# EAGLE design HB-UNI-SenAct-4-4-RC_V3.0 (EAGLE 9.4.2)
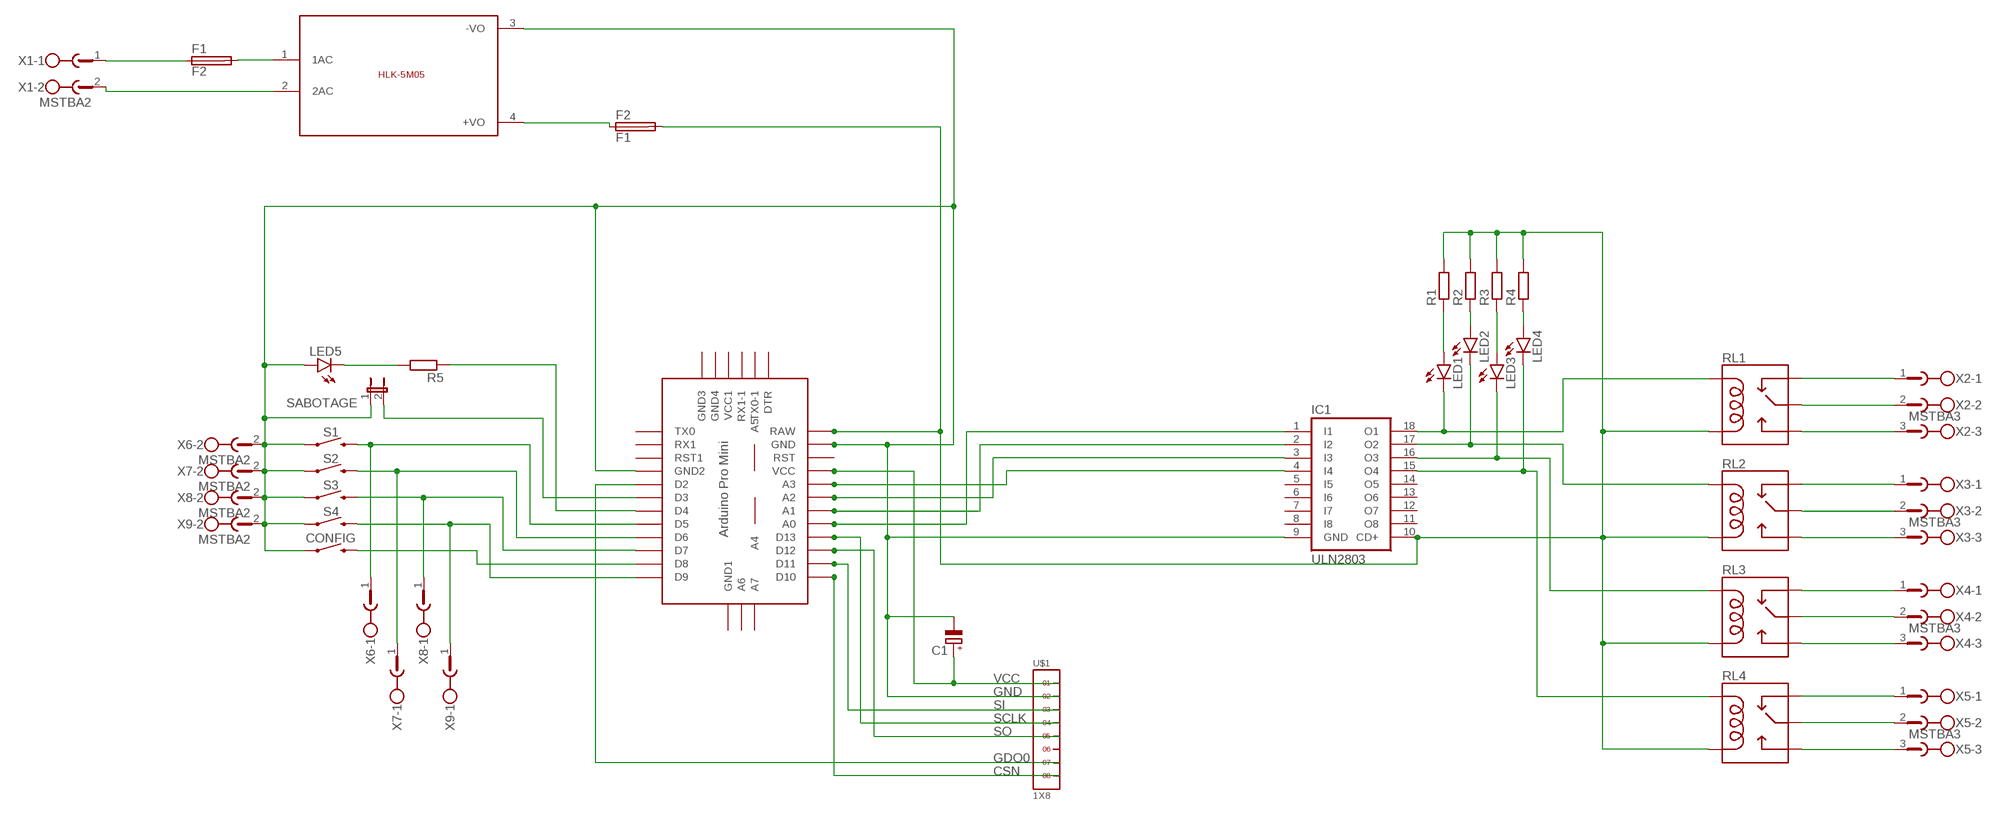
[diagram p0: schematic, sheet 1]

## Parts
C1  CPOL-EUE2.5-5  [E2,5-5]
CONFIG  MOMENTARY-SWITCH-SPST-PTH-6.0MM-KIT  [TACTILE_SWITCH_PTH_6.0MM_KIT]
F1  F2  SH22,5A  [SH22,5A]
F2  F1  SH22,5A  [SH22,5A]
IC1  ULN2803  ULN2803A  [DIL18]
LED1  LED3MM  [LED3MM]
LED2  LED3MM  [LED3MM]
LED3  LED3MM  [LED3MM]
LED4  LED3MM  [LED3MM]
LED5  LED3MM  [LED3MM]
R1  R-EU_0309/10  [0309/10]
R2  R-EU_0309/10  [0309/10]
R3  R-EU_0309/10  [0309/10]
R4  R-EU_0309/10  [0309/10]
R5  R-EU_0309/10  [0309/10]
RL1  RELAYPTH  [SRD-05VDC-SL-C]
RL2  RL2  RELAYPTH  [SRD-05VDC-SL-C]
RL3  RELAYPTH  [SRD-05VDC-SL-C]
RL4  RELAYPTH  [SRD-05VDC-SL-C]
S1  MOMENTARY-SWITCH-SPST-PTH-6.0MM  [TACTILE_SWITCH_PTH_6.0MM]
S2  MOMENTARY-SWITCH-SPST-PTH-6.0MM-KIT  [TACTILE_SWITCH_PTH_6.0MM_KIT]
S3  MOMENTARY-SWITCH-SPST-PTH-6.0MM-KIT  [TACTILE_SWITCH_PTH_6.0MM_KIT]
S4  MOMENTARY-SWITCH-SPST-PTH-6.0MM-KIT  [TACTILE_SWITCH_PTH_6.0MM_KIT]
SABOTAGE  JP1E  [JP1]
U$1  1X8  [1X8]
U$2  ABK-PRO-MINI  [ABK-PRO-MINI]
U$3  5VDC/5W  HLK-5M05  [HLK-5M05]
X1  MSTBA2  [MSTBA2]
X2  MSTBA3  [MSTBA3]
X3  MSTBA3  [MSTBA3]
X4  MSTBA3  [MSTBA3]
X5  MSTBA3  [MSTBA3]
X6  MSTBA2  [MSTBA2]
X7  MSTBA2  [MSTBA2]
X8  MSTBA2  [MSTBA2]
X9  MSTBA2  [MSTBA2]

## Nets
CSN: U$1.8 U$2.D10
GDO0: U$1.7 U$2.D2
GND: C1.- CONFIG.1 IC1.9(GND) LED5.A S1.1 S2.1 S3.1 S4.1 SABOTAGE.1 U$1.2 U$2.GND U$2.GND1(GND2) U$3.3(-VO) X6.2 X7.2 X8.2 X9.2
N$1: IC1.1(I1) U$2.A0
N$2: IC1.2(I2) U$2.A1
N$3: IC1.3(I3) U$2.A2
N$4: IC1.4(I4) U$2.A3
N$5: LED1.A R1.1
N$6: LED2.A R2.1
N$7: LED3.A R3.1
N$8: LED4.A R4.1
N$9: F1.1 X1.1
N$10: F2.1 U$3.4(+VO)
N$11: U$3.2(2AC) X1.2
N$12: S1.3 U$2.D5 X6.1
N$13: S2.3 U$2.D6 X7.1
N$14: S3.3 U$2.D7 X8.1
N$15: S4.3 U$2.D9 X9.1
N$16: CONFIG.3 U$2.D8
N$17: R5.1 U$2.D4
N$18: LED5.K(C) R5.2
N$19: F1.2 U$3.1(1AC)
N$20: SABOTAGE.2 U$2.D3
N$21: RL3.SWCLOSED(SWCLOSE) X4.1
N$22: RL4.SWCOMMON X5.2
N$23: RL3.SWOPEN X4.3
N$24: F2.2 IC1.10(CD+) R1.2 R2.2 R3.2 R4.2 RL1.COIL0 RL2.COIL0 RL3.COIL0 RL4.COIL0 U$2.RAW
N$25: RL4.SWCLOSED(SWCLOSE) X5.1
N$26: RL3.SWCOMMON X4.2
N$27: RL4.SWOPEN X5.3
N$28: RL2.SWOPEN X3.3
N$29: RL2.SWCOMMON X3.2
N$30: RL2.SWCLOSED(SWCLOSE) X3.1
N$31: RL1.SWOPEN X2.3
N$32: RL1.SWCOMMON X2.2
N$33: RL1.SWCLOSED(SWCLOSE) X2.1
N$34: IC1.18(O1) LED1.K(C) RL1.COIL1
N$35: IC1.17(O2) LED2.K(C) RL2.COIL1
N$36: IC1.16(O3) LED3.K(C) RL3.COIL1
N$37: IC1.15(O4) LED4.K(C) RL4.COIL1
SCLK: U$1.4 U$2.D13
SI: U$1.3 U$2.D11
SO: U$1.5 U$2.D12
VCC: C1.+ U$1.1 U$2.VCC
Unconnected: IC1.5(I5) IC1.6(I6) IC1.7(I7) IC1.8(I8) IC1.11(O8) IC1.12(O7) IC1.13(O6) IC1.14(O5) U$1.6 U$2.A4 U$2.A5 U$2.A6 U$2.A7 U$2.DTR U$2.GND2(GND3) U$2.GND3(GND4) U$2.GND4(GND1) U$2.RST U$2.RST1 U$2.RX1 U$2.RX1-1 U$2.TX0 U$2.TX0-1 U$2.VCC1

## Library data of the parts
C1 = resistor:CPOL-EU: POLARIZED CAPACITOR, European symbol
CONFIG S1-S4 = SparkFun-Switches:MOMENTARY-SWITCH-SPST: Momentary Switch (Pushbutton) - SPST Normally-open (NO) SPST momentary switches (buttons, pushbuttons). Variants PTH-12MM - 12mm square, through-hole Momentary Pushbutton Switch - 12mm Square <https://www.sparkfun.com/products/9190> (COM-09190) PTH-6.0MM, PTH-6.0MM-KIT - 6.0mm square, through-hole Mini Pushbutton Switch <https://www.sparkfun.com/products/97> (COM-00097) KIT package intended for soldering kit's - only one side of pads' copper is exposed. PTH-RIGHT-ANGLE-KIT - Right-angle, through-hole Right Angle Tactile Button <https://www.sparkfun.com/products/10791> - Used on SparkFun BigTime Watch Kit <https://www.sparkfun.com/products/11734> SMD-12MM - 12mm square, surface-mount Tactile Button - SMD (12mm) <https://www.sparkfun.com/products/12993> (COM-12993) Used on SparkFun PicoBoard <https://www.sparkfun.com/products/11888> SMD-4.5MM - 4.5mm Square Trackball Switch Used on SparkFun Blackberry Trackballer Breakout <https://www.sparkfun.com/products/13169> SMD-4.6MMX2.8MM - 4.60mm x 2.80mm, surface mount Used on SparkFun SAMD21 Mini Breakout <https://www.sparkfun.com/products/13664> SMD-5.2MM, SMD-5.2-REDUNDANT - 5.2mm square, surface-mount Mini Pushbutton Switch - SMD <https://www.sparkfun.com/products/8720> (COM-08720) Used on Arduino Pro Mini <https://www.sparkfun.com/products/11114> REDUNDANT package connects both switch circuits together SMD-6.0X3.5MM - 6.0 x 3.5mm, surface mount Momentary Reset Switch SMD <https://www.sparkfun.com/products/8229> (COM-08229) SMD-6.2MM-TALL - 6.2mm square, surface mount Tactile Button - SMD (6mm) <https://www.sparkfun.com/products/12992> Used on SparkFun Digital Sandbox <https://www.sparkfun.com/products/12651> SMD-RIGHT-ANGLE - Right-angle, surface mount Used on SparkFun Block for Intel® Edison - Arduino <https://www.sparkfun.com/products/13036>; PROD_ID: SWCH-08441; SF_SKU: COM-00097
F1 F2 = fuse:SH22,5A: FUSE HOLDER grid 22,5mm, isolated cap OGN0031 8201, Schurter (Buerklin); MPN: 0031.7701.11; OC_FARNELL: unknown; OC_NEWARK: 04F1224
IC1 = uln-udn:ULN2803A: DRIVER ARRAY
LED1-LED5 = led:LED: LED OSRAM: - CHIPLED LG R971, LG N971, LY N971, LG Q971, LY Q971, LO R971, LY R971 LH N974, LH R974 LS Q976, LO Q976, LY Q976 LO Q996 - Hyper CHIPLED LW Q18S LB Q993, LB Q99A, LB R99A - SideLED LS A670, LO A670, LY A670, LG A670, LP A670 LB A673, LV A673, LT A673, LW A673 LH A674 LY A675 LS A676, LA A676, LO A676, LY A676, LW A676 LS A679, LY A679, LG A679 - Hyper Micro SIDELED® LS Y876, LA Y876, LO Y876, LY Y876 LT Y87S - SmartLED LW L88C, LW L88S LB L89C, LB L89S, LG L890 LS L89K, LO L89K, LY L89K LS L896, LA L896, LO L896, LY L896 - TOPLED LS T670, LO T670, LY T670, LG T670, LP T670 LSG T670, LSP T670, LSY T670, LOP T670, LYG T670 LG T671, LOG T671, LSG T671 LB T673, LV T673, LT T673, LW T673 LH T674 LS T676, LA T676, LO T676, LY T676, LB T676, LH T676, LSB T676, LW T676 LB T67C, LV T67C, LT T67C, LS T67K, LO T67K, LY T67K, LW E67C LS E67B, LA E67B, LO E67B, LY E67B, LB E67C, LV E67C, LT E67C LW T67C LS T679, LY T679, LG T679 LS T770, LO T770, LY T770, LG T770, LP T770 LB T773, LV T773, LT T773, LW T773 LH T774 LS E675, LA E675, LY E675, LS T675 LS T776, LA T776, LO T776, LY T776, LB T776 LHGB T686 LT T68C, LB T68C - Hyper Mini TOPLED® LB M676 - Mini TOPLED Santana® LG M470 LS M47K, LO M47K, LY M47K Source: http://www.osram.convergy.de LUXEON: - LUMILED® LXK2-PW12-R00, LXK2-PW12-S00, LXK2-PW14-U00, LXK2-PW14-V00 LXK2-PM12-R00, LXK2-PM12-S00, LXK2-PM14-U00 LXK2-PE12-Q00, LXK2-PE12-R00, LXK2-PE12-S00, LXK2-PE14-T00, LXK2-PE14-U00 LXK2-PB12-K00, LXK2-PB12-L00, LXK2-PB12-M00, LXK2-PB14-N00, LXK2-PB14-P00, LXK2-PB14-Q00 LXK2-PR12-L00, LXK2-PR12-M00, LXK2-PR14-Q00, LXK2-PR14-R00 LXK2-PD12-Q00, LXK2-PD12-R00, LXK2-PD12-S00 LXK2-PH12-R00, LXK2-PH12-S00 LXK2-PL12-P00, LXK2-PL12-Q00, LXK2-PL12-R00 Source: www.luxeon.com KINGBRIGHT: KA-3528ASYC Source: www.kingbright.com
R1-R5 = resistor:R-EU_: RESISTOR, European symbol
RL1-RL4 = SRD-05VDC-SL-C:RELAY: SPDT relay (COM-00101)
SABOTAGE = jumper:JP1E: JUMPER
U$1 = headers(2mm):1X8
U$2 = Arduino-clone:ABK-PRO-MINI: ABK Pro-Mini Arduino Clone
U$3 = HLK-5M05:HLK-5M05: HLK-5M05 is an 5Volt/5W smps developed by HI-LINK; SIZE: 23x38(mm)
X1 X6-X9 = con-phoenix-508:MSTBA2: PHOENIX; MF: FARNELL; MPN: 1757242; OC_FARNELL: 3705171; OC_NEWARK: 71C4161
X2-X5 = con-phoenix-508:MSTBA3: PHOENIX; MF: FARNELL; MPN: 1757255; OC_FARNELL: 3705183; OC_NEWARK: 71C4162

## Board
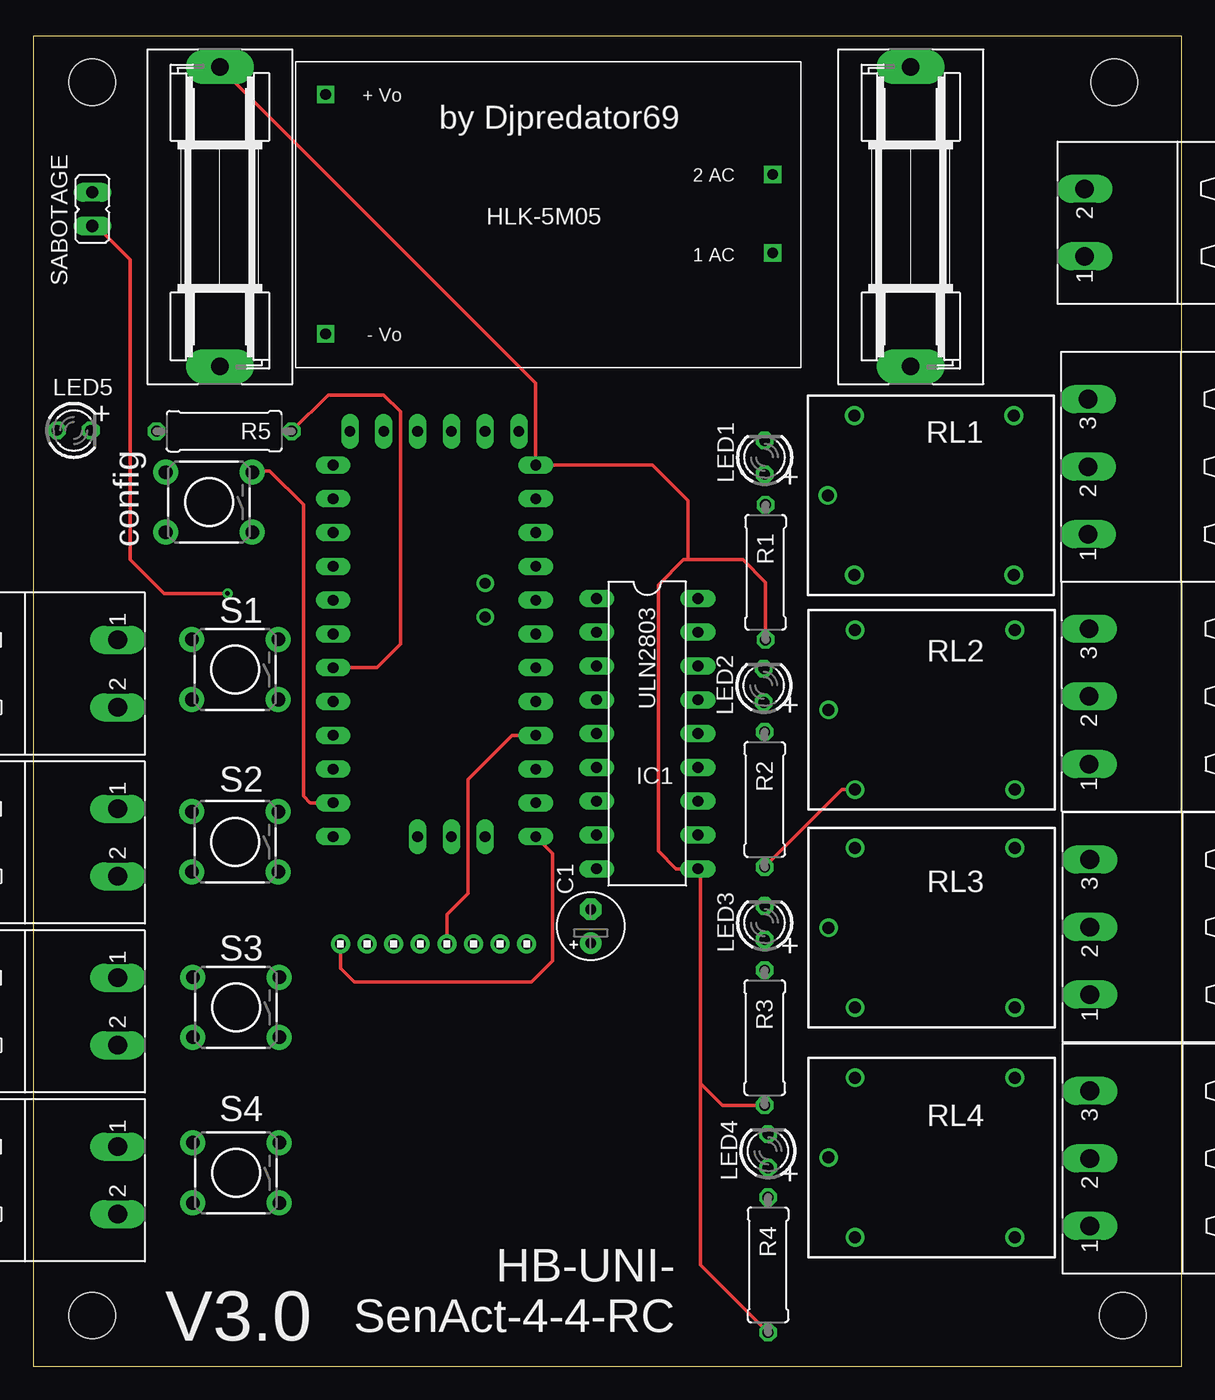
[diagram p1: board, top side]
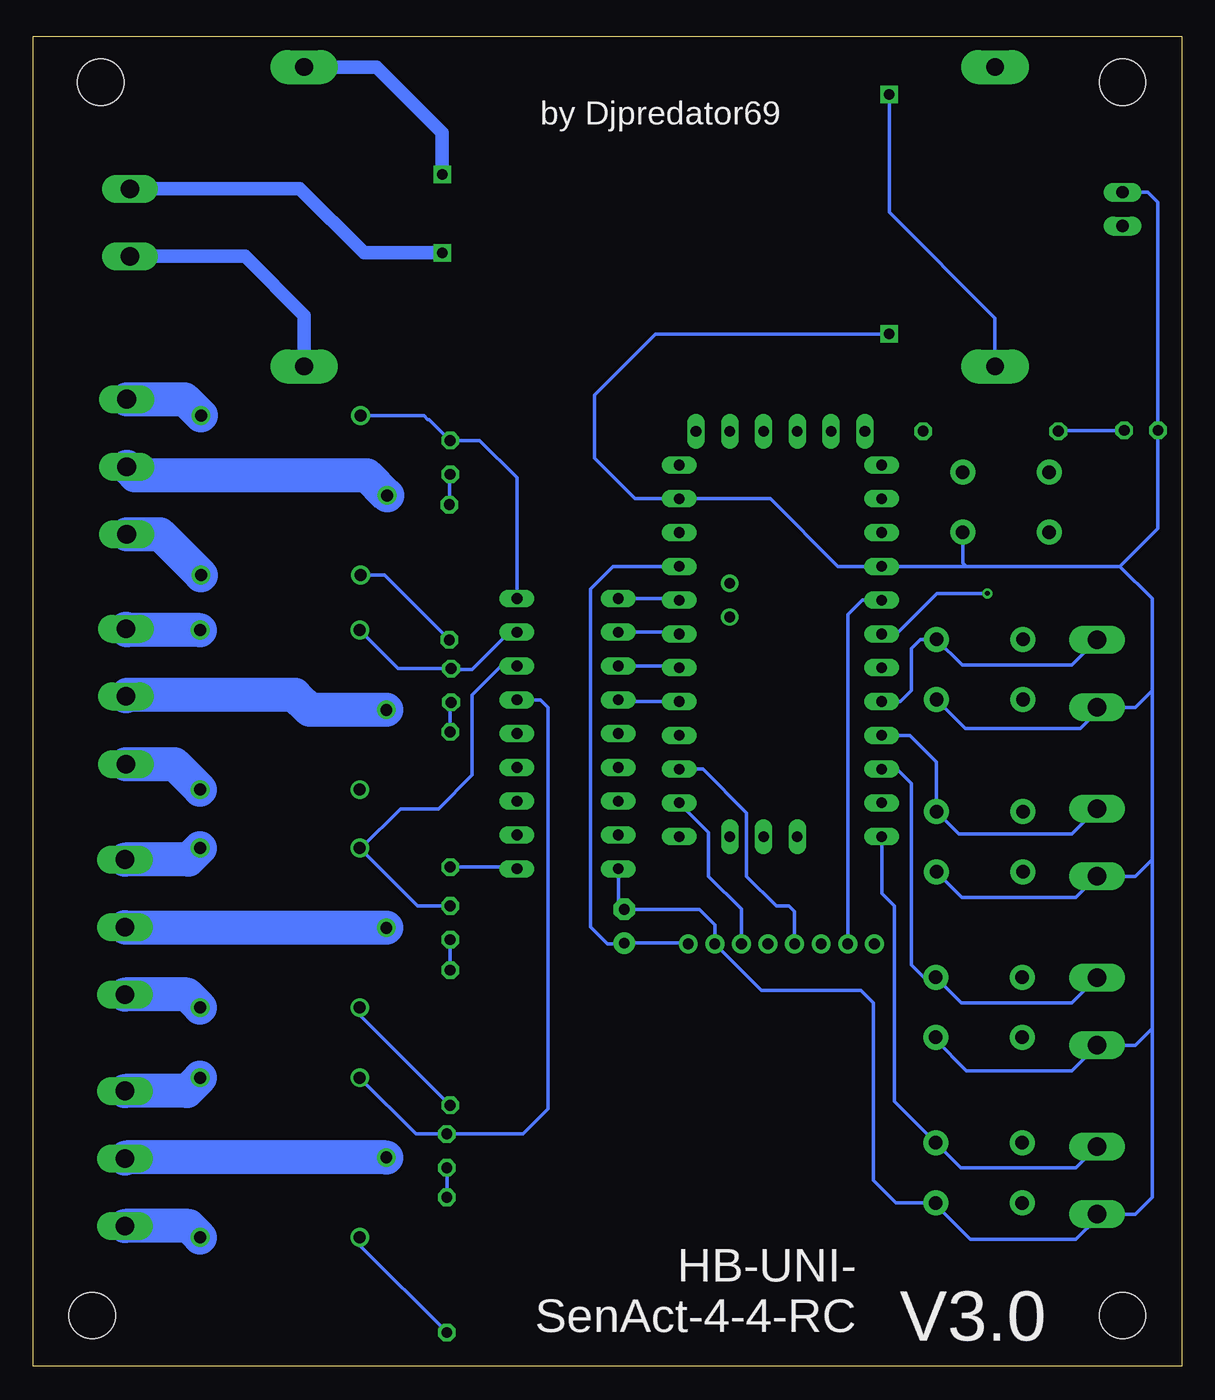
[diagram p2: board, bottom side, seen from below]

Size 86.34 x 100 mm. Coordinates in mm from the lower left corner, seen from the top.
Outline: 0,0 86.34,0 86.34,100 0,100 0,0
Copper layers (1*16): Top 0.035mm / dielectric 1.5mm / Bottom 0.035mm
Design rules "default": minimum track width 6mil, minimum drill 0.35mm, track to track 6mil, track to pad 6mil, pad to pad 6mil, via to via 6mil, smd to smd 6mil, copper to edge 40mil, drill to drill 6mil, minimum pad ring 10mil, minimum via ring 8mil, stop-mask expansion 4mil, vias tented up to drill 0mil, thermal gap 10mil
Holes 3.5 mm at 4.45,96.52 81.28,96.52 81.92,3.81 4.45,3.81

### Footprints (pad centres in the part's own frame; a part is rotated, then mirrored left to right if it is on the bottom)
E2,5-5 = drill 0.813 pad 1.6: + -1.27,0 | drill 0.813 pad 1.6 octagon: - 1.27,0
TACTILE_SWITCH_PTH_6.0MM_KIT = drill 1.016 pad 1.88: 1 -3.251,2.261; 2 3.251,2.261; 3 -3.251,-2.261; 4 3.251,-2.261
SH22,5A = drill 1.321 pad 2.54 long: 1 -11.252,0; 2 11.252,0
DIL18 = drill 0.813 long: 1 -10.16,-3.81; 2 -7.62,-3.81; 3 -5.08,-3.81; 4 -2.54,-3.81; 5 0,-3.81; 6 2.54,-3.81; 7 5.08,-3.81; 8 7.62,-3.81; 9 10.16,-3.81; 10 10.16,3.81; 11 7.62,3.81; 12 5.08,3.81; 13 2.54,3.81; 14 0,3.81; 15 -2.54,3.81; 16 -5.08,3.81; 17 -7.62,3.81; 18 -10.16,3.81
LED3MM = drill 0.813 octagon: A -1.27,0; K 1.27,0
0309/10 = drill 0.813 octagon: 1 -5.08,0; 2 5.08,0
SRD-05VDC-SL-C = drill 0.9: COIL0 -5.39,-6.12; COIL1 -5.39,5.88; SWCLOSED 6.61,-6.12; SWCOMMON -7.39,-0.12; SWOPEN 6.61,5.88
TACTILE_SWITCH_PTH_6.0MM = drill 1.016 pad 1.88: 1 -3.251,2.261; 2 3.251,2.261; 3 -3.251,-2.261; 4 3.251,-2.261
JP1 = drill 0.914 long: 1 0,-1.27; 2 0,1.27
1X8 = drill 0.8 pad 1.422: 1 -7,0; 2 -5,0; 3 -3,0; 4 -1,0; 5 1,0; 6 3,0; 7 5,0; 8 7,0
ABK-PRO-MINI = drill 0.8 long: A0 10.16,-3.81; A1 10.16,-6.35; A2 10.16,-8.89; A3 10.16,-11.43; A6 3.81,-21.59; A7 6.35,-21.59; D2 -5.08,-3.81; D3 -5.08,-6.35; D4 -5.08,-8.89; D5 -5.08,-11.43; D6 -5.08,-13.97; D7 -5.08,-16.51; D8 -5.08,-19.05; D9 -5.08,-21.59; D10 10.16,-21.59; D11 10.16,-19.05; D12 10.16,-16.51; D13 10.16,-13.97; DTR 8.89,8.89; GND 10.16,3.81; GND1 -5.08,-1.27; GND2 -3.81,8.89; GND3 -1.27,8.89; GND4 1.27,-21.59; RAW 10.16,6.35; RST 10.16,1.27; RST1 -5.08,1.27; RX1 -5.08,3.81; RX1-1 3.81,8.89; TX0 -5.08,6.35; TX0-1 6.35,8.89; VCC 10.16,-1.27; VCC1 1.27,8.89 | drill 0.8: A4 6.35,-5.08; A5 6.35,-2.54
HLK-5M05 = drill 0.8 square: 1 -16.85,-2.93; 2 -16.85,2.97; 3 16.75,9.07; 4 16.75,-8.93
MSTBA2 = drill 1.397 long: 1 -2.54,5.08; 2 2.54,5.08
MSTBA3 = drill 1.397 long: 1 -5.08,5.08; 2 0,5.08; 3 5.08,5.08

### Placement (x,y rotation side)
C1  41.91,33.08 90 top
CONFIG  13.21,64.96 180 top
F1  65.98,86.42 90 top
F2  14.03,86.42 90 top
IC1  46.16,47.56 270 top
LED1  54.99,68.33 90 top
LED2  54.93,51.18 90 top
LED3  54.99,33.34 90 top
LED4  55.24,16.19 90 top
LED5  3.05,70.36 0 top
R1  55.05,59.69 270 top
R2  54.99,42.61 270 top
R3  54.99,24.7 270 top
R4  55.24,7.62 270 top
R5  14.35,70.29 180 top
RL1  67.12,65.6 0 top
RL2  67.18,49.47 0 top
RL3  67.18,33.08 0 top
RL4  67.18,15.81 0 top
S1  15.18,52.39 180 top
S2  15.18,39.43 180 top
S3  15.24,26.99 180 top
S4  15.24,14.54 180 top
SABOTAGE  4.45,87 180 top
U$1  30.1,31.75 180 top
U$2  27.62,61.4 0 top
U$3  38.73,86.68 180 top
X1  84.14,85.98 90 top
X2  84.39,67.63 90 top
X3  84.45,50.36 90 top
X4  84.52,33.02 90 top
X5  84.52,15.62 90 top
X6  1.27,52.07 270 top
X7  1.27,39.37 270 top
X8  1.27,26.67 270 top
X9  1.27,13.97 270 top

### Tracks (layer width: path | path; a pad name or v marks a point on that pad's centre or on a via)
CSN
  Top 0.254: U$1.8 23.1,29.92 24.13,28.89 37.47,28.89 39.05,30.48 39.05,38.54 U$2.D10
GDO0
  Bottom 0.254: U$2.D2 24,57.59 25.1,56.5 U$1.7
GND
  Bottom 0.254: IC1.9 42.35,34.8 C1.- 36.26,34.35 35.1,33.19 U$1.2 31.61,28.26 24.13,28.26 23.18,27.3 23.18,13.97 21.49,12.28 S4.1 18.49,12.14 15.88,9.53 7.94,9.53 6.35,11.11 X9.2 3.49,11.43 2.22,12.7 2.22,25.4 | SABOTAGE.1 2.54,88.27 1.78,87.5 LED5.A 1.78,62.99 4.64,60.13 | 16.19,60.13 U$2.GND1 25.84,60.13 30.92,65.22 U$2.GND 41.08,65.22 44.13,68.26 44.13,73.03 39.55,77.61 U$3.3 | 16.19,60.13 4.64,60.13 | CONFIG.1 16.46,60.4 16.19,60.13 | 4.64,60.13 2.22,57.72 2.22,50.8 | 2.22,50.8 2.22,38.1 | 2.22,38.1 2.22,25.4 | 2.22,25.4 3.49,24.13 X8.2 8.26,22.23 16.19,22.23 18.49,24.52 S3.1 | 2.22,38.1 3.49,36.83 X7.2 7.94,35.24 16.51,35.24 S2.1 | X6.2 6.03,49.53 | 6.03,49.53 3.49,49.53 2.22,50.8 | S1.1 16.24,47.94 7.62,47.94 6.03,49.53
N$1
  Bottom 0.254: U$2.A0 37.91,57.72 IC1.1
N$2
  Bottom 0.254: U$2.A1 37.91,55.18 IC1.2
N$3
  Bottom 0.254: U$2.A2 37.91,52.64 IC1.3
N$4
  Bottom 0.254: U$2.A3 42.23,49.97 IC1.4
N$5
  Bottom 0.254: R1.1 55.05,66.99 LED1.A
N$6
  Bottom 0.254: LED2.A 54.99,49.85 R2.1
N$7
  Bottom 0.254: R3.1 LED3.A
N$8
  Bottom 0.254: R4.1 LED4.A
N$9
  Bottom 1.016: X1.1 70.42,83.44 65.98,78.99 F1.1
N$10
  Bottom 0.254: F2.1 14.03,78.8 21.98,86.75 U$3.4
N$11
  Bottom 1.016: X1.2 66.29,88.52 61.48,83.71 U$3.2
N$12
  Bottom 0.254: X6.1 8.26,52.7 16.48,52.7 S1.3 19.65,54.65 20.32,53.98 20.32,50.8 21.14,49.97 U$2.D5
N$13
  Bottom 0.254: X7.1 8.26,40.01 16.74,40.01 S2.3 18.43,45.41 20.45,47.43 U$2.D6
N$14
  Bottom 0.254: X8.1 8.26,27.3 16.55,27.3 18.43,29.19 | 18.43,29.19 S3.3 | U$2.D7 21.4,44.9 20.32,43.81 20.32,30.16 19.35,29.19 18.43,29.19
N$15
  Bottom 0.254: X9.1 7.94,14.92 16.61,14.92 S4.3 21.59,19.9 21.59,34.61 22.54,35.56 U$2.D9
N$16
  Top 0.254: U$2.D8 20.83,42.35 20.32,42.86 20.32,64.77 17.78,67.31 16.55,67.31 CONFIG.3
N$17
  Top 0.254: R5.1 22.16,73.03 26.35,73.03 27.62,71.75 27.62,54.29 25.84,52.51 U$2.D4
N$18
  Bottom 0.254: LED5.K 9.21,70.36 R5.2
N$19
  Bottom 1.016: F1.2 60.53,97.68 55.59,92.73 U$3.1
N$20  (via drill 0.35)
  Top 0.254: v14.61,58.1 9.84,58.1 7.3,60.64 7.3,83.19 4.76,85.72 SABOTAGE.2
  Bottom 0.254: U$2.D3 21.46,55.05 18.41,58.1 v14.61,58.1
N$21
  Bottom 2.54: RL3.SWCLOSED 74.77,27.94 X4.1
N$22
  Bottom 2.54: RL4.SWCOMMON 79.37,15.69 X5.2
N$23
  Bottom 2.54: RL3.SWOPEN 74.66,38.1 X4.3
N$24
  Top 0.254: R4.2 50.16,7.62 50.16,21.27 | 50.16,21.27 50.16,37.21 IC1.10 48.32,37.4 46.99,38.73 46.99,58.74 48.9,60.64 49.21,60.64 | R3.2 51.82,19.62 50.16,21.27 | 49.21,60.64 53.34,60.64 55.05,58.93 R1.2 | 49.21,60.64 49.21,65.09 46.55,67.75 U$2.RAW 37.78,73.93 F2.2 | R2.2 60.81,43.35 RL2.COIL0
  Bottom 0.254: R1.2 59.92,59.48 RL1.COIL0 | IC1.10 50.1,37.53 R2.2 | R3.2 61.79,26.42 RL3.COIL0 | R4.2 61.79,9.09 RL4.COIL0
N$25
  Bottom 2.54: RL4.SWCLOSED 74.64,10.54 X5.1
N$26
  Bottom 2.54: RL3.SWCOMMON 79.38,32.96 X4.2
N$27
  Bottom 2.54: RL4.SWOPEN 74.78,20.7 X5.3
N$28
  Bottom 2.54: RL2.SWOPEN 79.29,55.35 X3.3
N$29
  Bottom 2.54: RL2.SWCOMMON 65.54,49.35 66.67,50.48 79.25,50.48 X3.2
N$30
  Bottom 2.54: X3.1 75.72,45.28 RL2.SWCLOSED
N$31
  Bottom 2.54: X2.3 74.96,72.71 RL1.SWOPEN
N$32
  Bottom 2.54: X2.2 78.68,66.99 61.25,66.99 RL1.SWCOMMON
N$33
  Bottom 2.54: X2.1 76.8,62.55 RL1.SWCLOSED
N$34
  Bottom 0.254: RL1.COIL1 56.97,71.47 56.67,71.18 56.58,71.18 LED1.K 52.77,69.6 49.97,66.8 IC1.18
N$35
  Bottom 0.254: RL2.COIL1 58.9,52.45 LED2.K 54.86,52.39 53.34,52.39 50.55,55.18 IC1.17
N$36
  Bottom 0.254: IC1.16 51.18,52.64 53.34,50.48 53.34,44.45 55.88,41.91 58.74,41.91 61.68,38.96 RL3.COIL1 57.44,34.61 LED3.K
N$37
  Bottom 0.254: RL4.COIL1 57.56,17.46 LED4.K 49.53,17.46 47.62,19.37 47.62,49.53 48.2,50.1 IC1.15
SCLK
  Top 0.254: U$2.D13 36.01,47.43 32.7,44.13 32.7,35.56 31.1,33.96 U$1.4
SI
  Bottom 0.254: U$1.3 33.1,34.37 35.56,36.83 35.56,40.13 U$2.D11
SO
  Bottom 0.254: U$2.D12 36.01,44.9 32.7,41.59 32.7,36.83 30.48,34.61 29.53,34.61 29.1,34.18 U$1.5
VCC
  Bottom 0.254: U$1.1 37.16,31.81 C1.+ 41.97,31.75 43.18,31.75 44.45,33.02 44.45,58.42 42.74,60.13 U$2.VCC

### Text on the board
tNames: by Djpredator69 | + | + | config | S1 | + | S2 | + | S3 | S4 | + | HB-UNI- / SenAct-4-4-RC | V3.0
bNames: by Djpredator69 | HB-UNI- / SenAct-4-4-RC | V3.0